# EAGLE board adc8_v2 (EAGLE 5.12), part 1 of 2
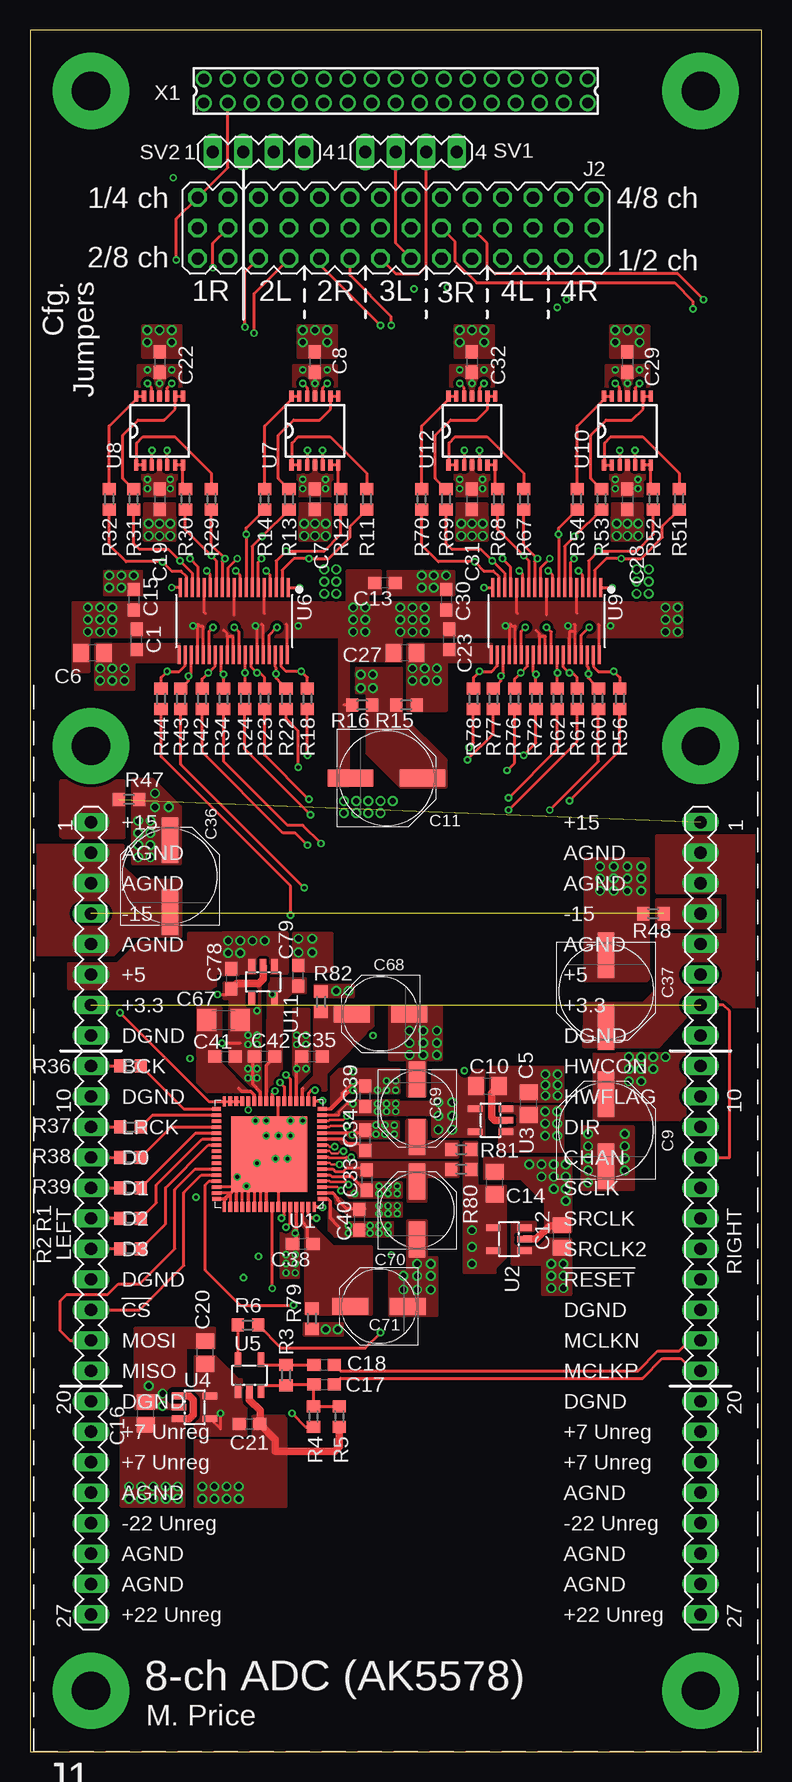
[diagram p3: board, top side]
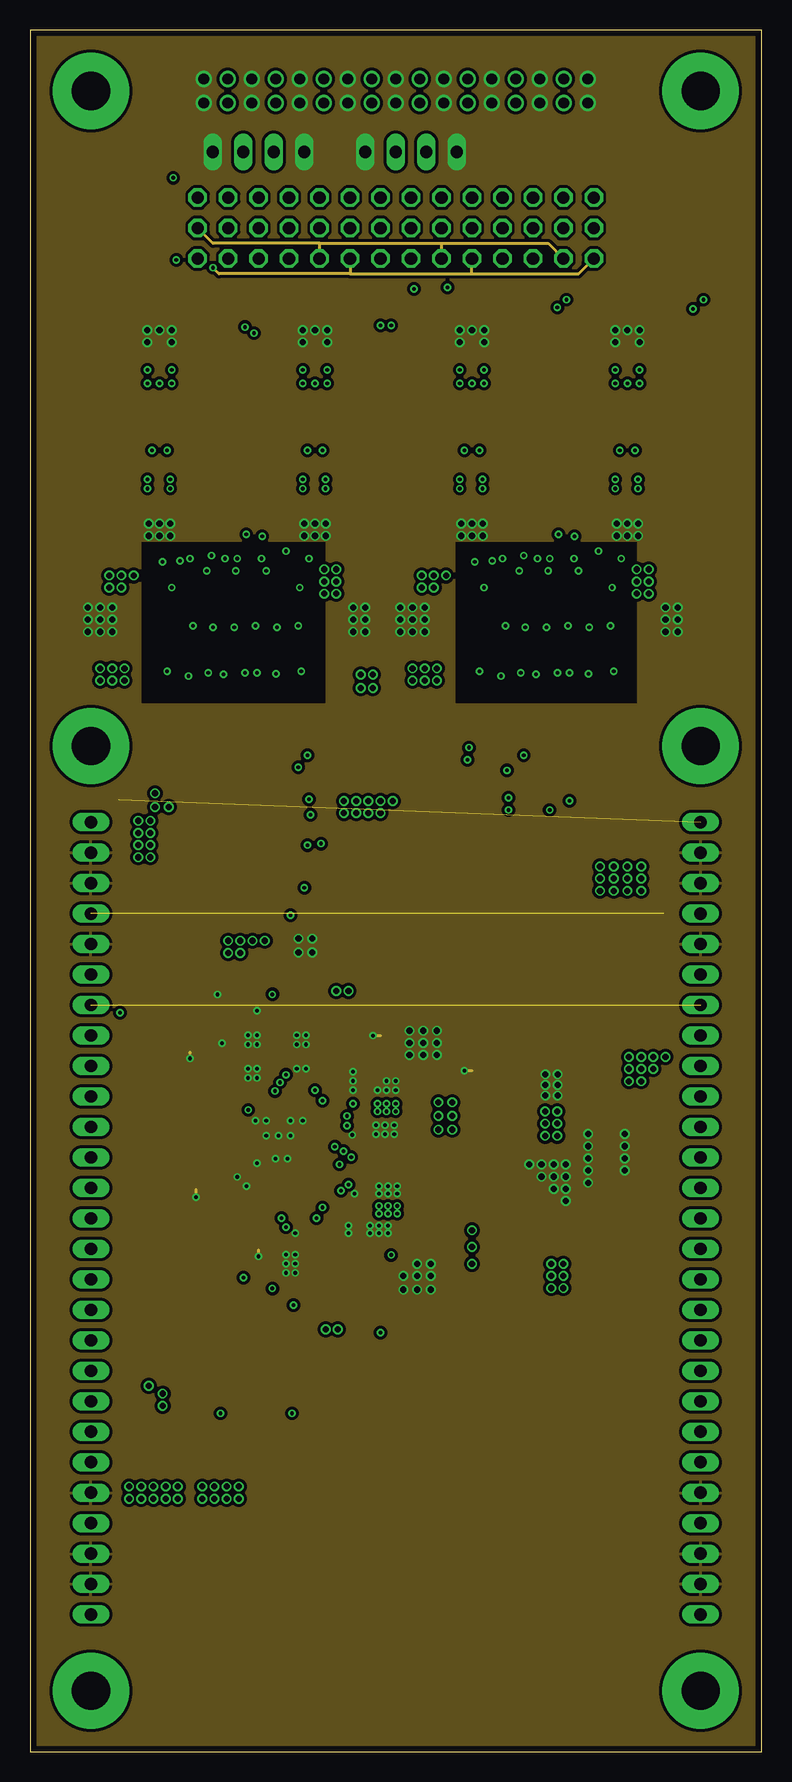
[diagram p4: board, inner layer Route2]
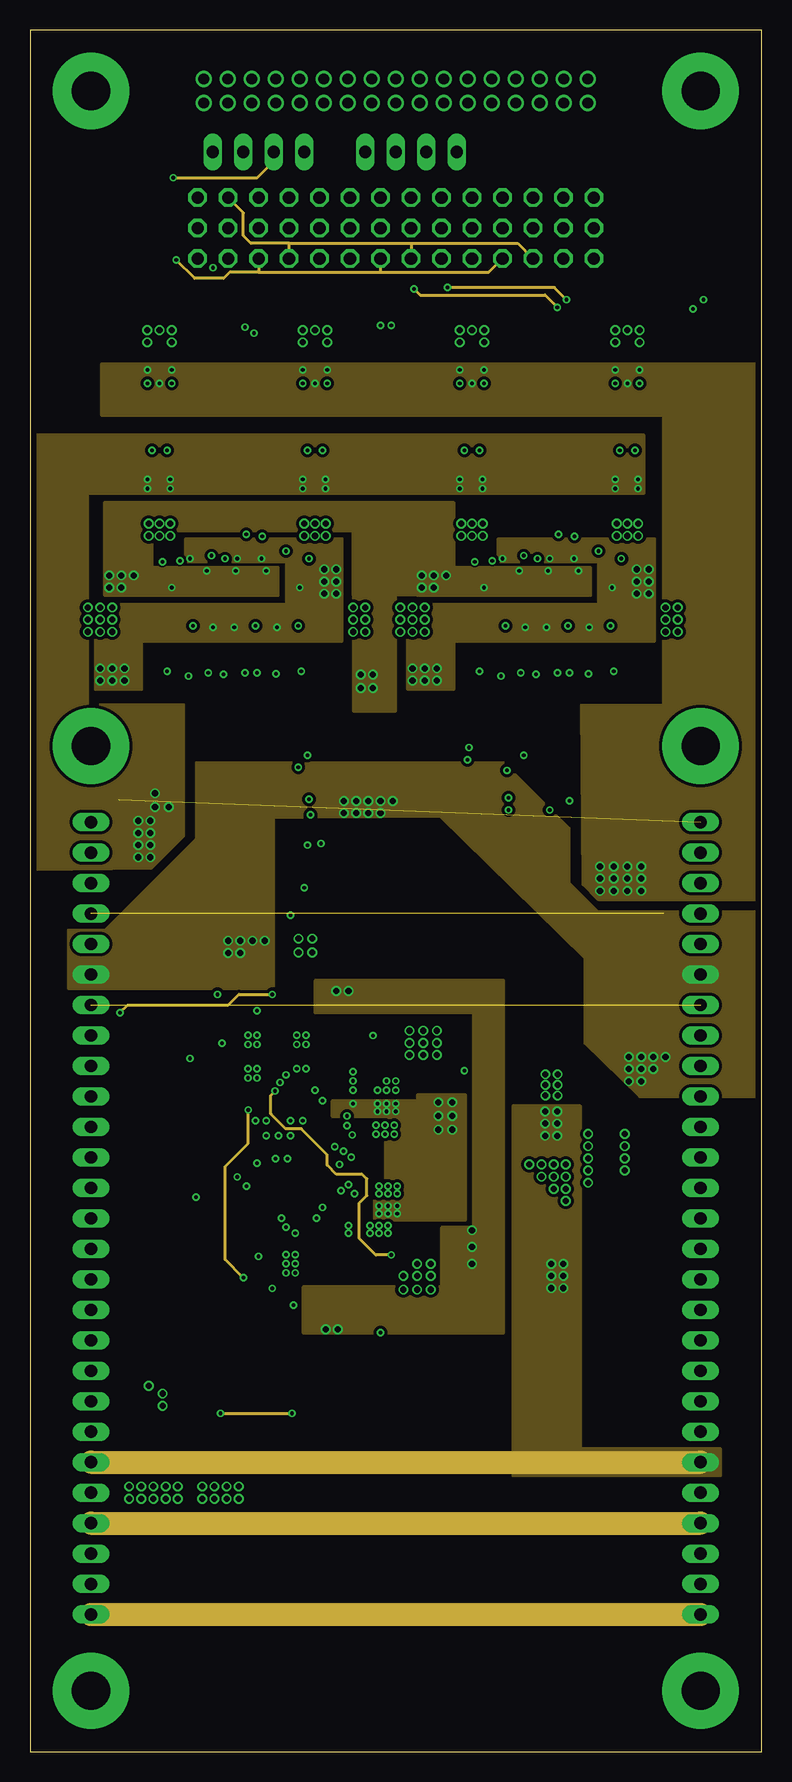
[diagram p5: board, inner layer Route15]
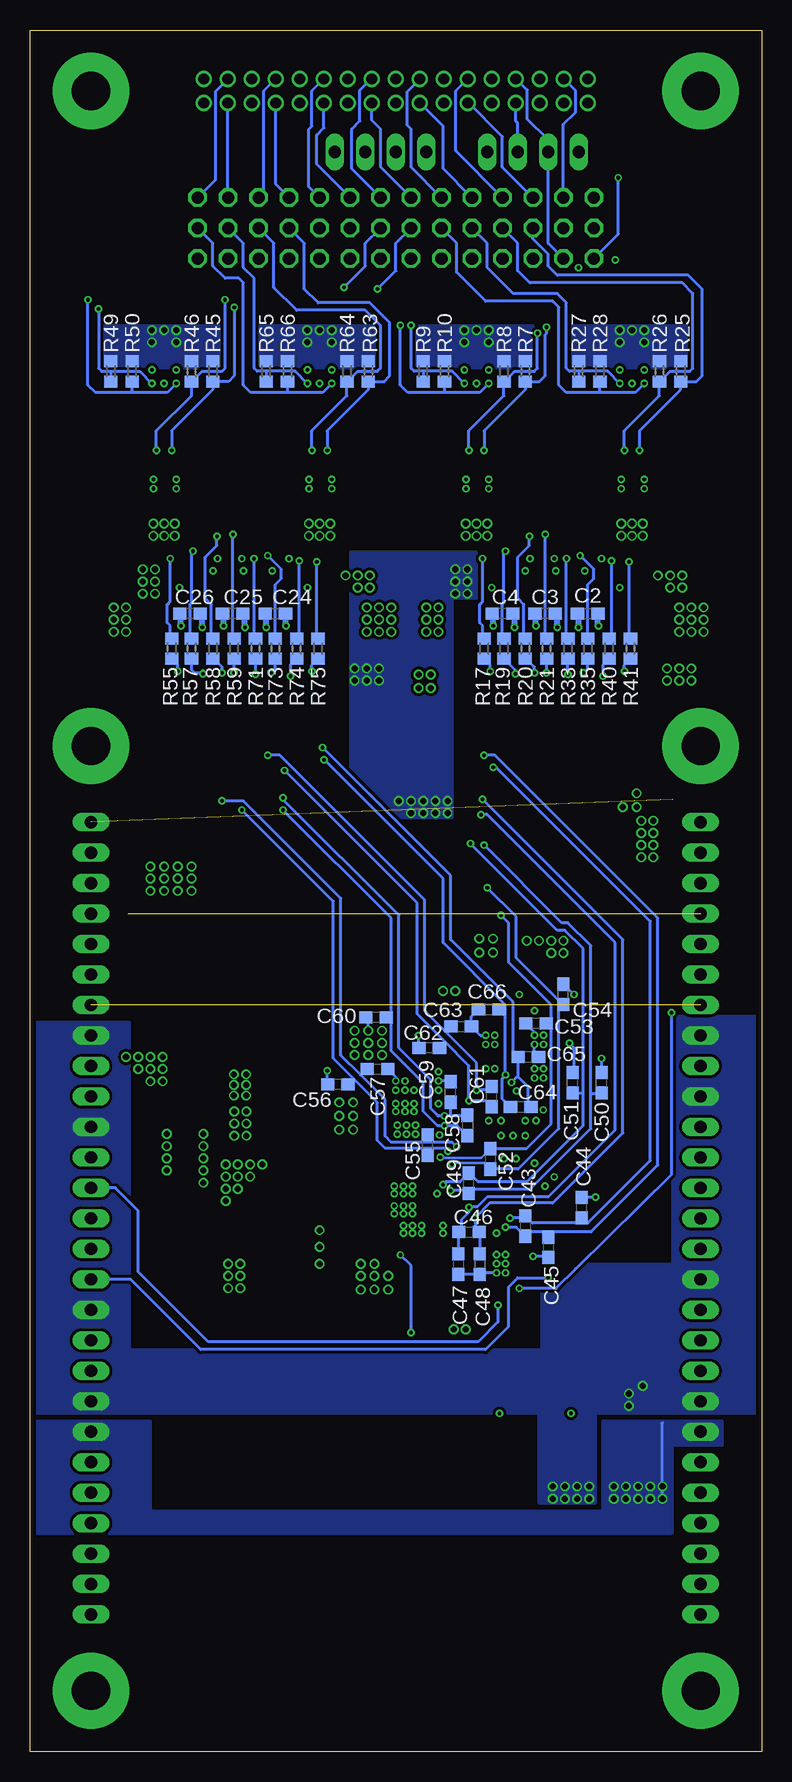
[diagram p6: board, bottom side, seen from below]

Size 60.96 x 143.51 mm. Coordinates in mm from the lower left corner, seen from the top.
Outline: 60.96,143.51 0,143.51 0,0 60.96,0 60.96,143.51
Copper layers (1*2*15*16): Top 0.035mm / dielectric 0.2mm / Route2 0.035mm / dielectric 1.2mm / Route15 0.035mm / dielectric 0.2mm / Bottom 0.035mm
Design rules "Elecrow_4-layer_PCB_eagle_rule": minimum track width 6mil, minimum drill 12mil, track to track 6mil, track to pad 6mil, pad to pad 6mil, via to via 8mil, smd to smd 0mil, copper to edge 20mil, drill to drill 10mil, minimum pad ring 6mil, minimum via ring 6mil, stop-mask expansion 0mil, vias tented up to drill 100mil, thermal gap 10mil

## Footprints (pad centres in the part's own frame; a part is rotated, then mirrored left to right if it is on the bottom)
C0603 = smd 1.1 x 1: 1 -0.85,0; 2 0.85,0
C0805 = smd 1.3 x 1.5: 1 -0.95,0; 2 0.95,0
PANASONIC_E = smd 3.8 x 1.4: + 3,0; - -3,0
C1206 = smd 1.6 x 1.8: 1 -1.4,0; 2 1.4,0
PANASONIC_D = smd 3 x 1.4: + 2.4,0; - -2.4,0
MOD-V2 = drill 1.016 long: 1L -25.4,33.02; 1R 25.4,33.02; 2L -25.4,30.48; 2R 25.4,30.48; 3L -25.4,27.94; 3R 25.4,27.94; 4L -25.4,25.4; 4R 25.4,25.4; 5L -25.4,22.86; 5R 25.4,22.86; 6L -25.4,20.32; 6R 25.4,20.32; 7L -25.4,17.78; 7R 25.4,17.78; 8L -25.4,15.24; 8R 25.4,15.24; 9L -25.4,12.7; 9R 25.4,12.7; 10L -25.4,10.16; 10R 25.4,10.16; 11L -25.4,7.62; 11R 25.4,7.62; 12L -25.4,5.08; 12R 25.4,5.08; 13L -25.4,2.54; 13R 25.4,2.54; 14L -25.4,0; 14R 25.4,0; 15L -25.4,-2.54; 15R 25.4,-2.54; 16L -25.4,-5.08; 16R 25.4,-5.08; 17L -25.4,-7.62; 17R 25.4,-7.62; 18L -25.4,-10.16; 18R 25.4,-10.16; 19L -25.4,-12.7; 19R 25.4,-12.7; 20L -25.4,-15.24; 20R 25.4,-15.24; 21L -25.4,-17.78; 21R 25.4,-17.78; 22L -25.4,-20.32; 22R 25.4,-20.32; 23L -25.4,-22.86; 23R 25.4,-22.86; 24L -25.4,-25.4; 24R 25.4,-25.4; 25L -25.4,-27.94; 25R 25.4,-27.94; 26L -25.4,-30.48; 26R 25.4,-30.48; 27L -25.4,-33.02; 27R 25.4,-33.02 | drill 3.175 pad 6.35 round: DP1 -25.4,39.37; DP2 25.4,39.37; DP3 -25.4,-39.37; DP4 25.4,-39.37
MA14-3 = drill 1.016 octagon: 1A -16.51,-2.54; 1B -16.51,0; 1C -16.51,2.54; 2A -13.97,-2.54; 2B -13.97,0; 2C -13.97,2.54; 3A -11.43,-2.54; 3B -11.43,0; 3C -11.43,2.54; 4A -8.89,-2.54; 4B -8.89,0; 4C -8.89,2.54; 5A -6.35,-2.54; 5B -6.35,0; 5C -6.35,2.54; 6A -3.81,-2.54; 6B -3.81,0; 6C -3.81,2.54; 7A -1.27,-2.54; 7B -1.27,0; 7C -1.27,2.54; 8A 1.27,-2.54; 8B 1.27,0; 8C 1.27,2.54; 9A 3.81,-2.54; 9B 3.81,0; 9C 3.81,2.54; 10A 6.35,-2.54; 10B 6.35,0; 10C 6.35,2.54; 11A 8.89,-2.54; 11B 8.89,0; 11C 8.89,2.54; 12A 11.43,-2.54; 12B 11.43,0; 12C 11.43,2.54; 13A 13.97,-2.54; 13B 13.97,0; 13C 13.97,2.54; 14A 16.51,-2.54; 14B 16.51,0; 14C 16.51,2.54
R0603 = smd 1 x 1.1: 1 -0.85,0; 2 0.85,0
MA04-1 = drill 1.016 long: 1 -3.81,0; 2 -1.27,0; 3 1.27,0; 4 3.81,0
QFN64_EP_AKM = smd 0.8 x 0.3: 1 -4.4,3.75; 2 -4.4,3.25; 3 -4.4,2.75; 4 -4.4,2.25; 5 -4.4,1.75; 6 -4.4,1.25; 7 -4.4,0.75; 8 -4.4,0.25; 9 -4.4,-0.25; 10 -4.4,-0.75; 11 -4.4,-1.25; 12 -4.4,-1.75; 13 -4.4,-2.25; 14 -4.4,-2.75; 15 -4.4,-3.25; 16 -4.4,-3.75; 33 4.4,-3.75; 34 4.4,-3.25; 35 4.4,-2.75; 36 4.4,-2.25; 37 4.4,-1.75; 38 4.4,-1.25; 39 4.4,-0.75; 40 4.4,-0.25; 41 4.4,0.25; 42 4.4,0.75; 43 4.4,1.25; 44 4.4,1.75; 45 4.4,2.25; 46 4.4,2.75; 47 4.4,3.25; 48 4.4,3.75 | smd 0.3 x 0.8: 17 -3.75,-4.4; 18 -3.25,-4.4; 19 -2.75,-4.4; 20 -2.25,-4.4; 21 -1.75,-4.4; 22 -1.25,-4.4; 23 -0.75,-4.4; 24 -0.25,-4.4; 25 0.25,-4.4; 26 0.75,-4.4; 27 1.25,-4.4; 28 1.75,-4.4; 29 2.25,-4.4; 30 2.75,-4.4; 31 3.25,-4.4; 32 3.75,-4.4; 49 3.75,4.4; 50 3.25,4.4; 51 2.75,4.4; 52 2.25,4.4; 53 1.75,4.4; 54 1.25,4.4; 55 0.75,4.4; 56 0.25,4.4; 57 -0.25,4.4; 58 -0.75,4.4; 59 -1.25,4.4; 60 -1.75,4.4; 61 -2.25,4.4; 62 -2.75,4.4; 63 -3.25,4.4; 64 -3.75,4.4 | smd 6.3 x 6.3: EP 0,0
SOT23-DBV = smd 0.55 x 1.2: 1 -0.95,-1.3; 2 0,-1.3; 3 0.95,-1.3; 4 0.95,1.3; 5 -0.95,1.3
TSSOP38_R-PDSO-G38-DA = smd 0.25 x 1.55: 1 -4.5,-2.8; 2 -4,-2.8; 3 -3.5,-2.8; 4 -3,-2.8; 5 -2.5,-2.8; 6 -2,-2.8; 7 -1.5,-2.8; 8 -1,-2.8; 9 -0.5,-2.8; 10 0,-2.8; 11 0.5,-2.8; 12 1,-2.8; 13 1.5,-2.8; 14 2,-2.8; 15 2.5,-2.8; 16 3,-2.8; 17 3.5,-2.8; 18 4,-2.8; 19 4.5,-2.8; 20 4.6,2.8; 21 4.1,2.8; 22 3.6,2.8; 23 3.1,2.8; 24 2.6,2.8; 25 2.1,2.8; 26 1.6,2.8; 27 1.1,2.8; 28 0.6,2.8; 29 0.1,2.8; 30 -0.4,2.8; 31 -0.9,2.8; 32 -1.4,2.8; 33 -1.9,2.8; 34 -2.4,2.8; 35 -2.9,2.8; 36 -3.4,2.8; 37 -3.9,2.8; 38 -4.4,2.8
TSSOP14 = smd 0.9 x 0.35: 1 -2.875,1.95; 2 -2.875,1.3; 3 -2.875,0.65; 4 -2.875,0; 5 -2.875,-0.65; 6 -2.875,-1.3; 7 -2.875,-1.95; 8 2.875,-1.95; 9 2.875,-1.3; 10 2.875,-0.65; 11 2.875,0; 12 2.875,0.65; 13 2.875,1.3; 14 2.875,1.95
87758-3416 = drill 0.9 pad 1.27 round: 1 -16,-1; 2 -16,1; 3 -14,-1; 4 -14,1; 5 -12,-1; 6 -12,1; 7 -10,-1; 8 -10,1; 9 -8,-1; 10 -8,1; 11 -6,-1; 12 -6,1; 13 -4,-1; 14 -4,1; 15 -2,-1; 16 -2,1; 17 0,-1; 18 0,1; 19 2,-1; 20 2,1; 21 4,-1; 22 4,1; 23 6,-1; 24 6,1; 25 8,-1; 26 8,1; 27 10,-1; 28 10,1; 29 12,-1; 30 12,1; 31 14,-1; 32 14,1; 33 16,-1; 34 16,1

## Placement (x,y rotation side)
C1  0.1u  [C0603]  8.89,92.71 90 top
C2  0.1u  [C0603]  14.48,94.87 0 bottom
C3  0.1u  [C0603]  18.03,94.87 180 bottom
C4  0.1u  [C0603]  21.59,94.87 180 bottom
C5  2.2u  [C0805]  41.55,54.03 90 top
C6  2.2u  [C0805]  5.21,91.57 180 top
C7  0.1u  [C0603]  23.75,104.39 270 top
C8  0.1u  [C0603]  23.75,115.82 270 top
C9  220u  [PANASONIC_E]  48.01,51.82 90 top
C10  2.2u  [C0805]  38.13,55.5 0 top
C11  100u  [PANASONIC_E]  29.72,81.15 0 top
C12  2.2u  [C0805]  44.32,42.95 90 top
C13  0.1u  [C0603]  29.59,97.41 180 top
C14  2.2u  [C0805]  38.73,47.4 90 top
C15  1u  [C0603]  8.64,96.01 270 top
C16  2.2u  [C0805]  9.65,28.19 90 top
C17  10n  [C0603]  24.51,30.61 0 top
C18  10n  [C0603]  24.51,32.26 0 top
C19  0.1u  [C0603]  10.79,104.39 270 top
C20  2.2u  [C0805]  14.61,33.27 90 top
C21  0.1u  [C0603]  18.29,27.3 0 top
C22  0.1u  [C0603]  10.79,115.82 270 top
C23  0.1u  [C0603]  34.92,92.71 90 top
C24  0.1u  [C0603]  40.51,94.87 0 bottom
C25  0.1u  [C0603]  44.07,94.87 180 bottom
C26  0.1u  [C0603]  47.62,94.87 180 bottom
C27  2.2u  [C0805]  31.24,91.57 180 top
C28  0.1u  [C0603]  49.78,104.39 270 top
C29  0.1u  [C0603]  49.78,115.82 270 top
C30  1u  [C0603]  34.67,96.01 270 top
C31  0.1u  [C0603]  36.83,104.39 270 top
C32  0.1u  [C0603]  36.83,115.82 270 top
C33  0.1u  [C0603]  28.07,47.65 270 top
C34  0.1u  [C0603]  27.94,50.95 90 top
C35  0.1u  [C0603]  23.5,57.94 180 top
C36  100u  [PANASONIC_E]  11.66,72.97 90 top
C37  100u  [PANASONIC_E]  48.01,63.37 270 top
C38  0.1u  [C0603]  22.73,42.32 180 top
C39  0.1u  [C0603]  27.94,54.64 90 top
C40  0.1u  [C0603]  27.43,44.35 270 top
C41  0.1u  [C0603]  16.26,57.94 0 top
C42  0.1u  [C0603]  19.56,57.94 180 top
C43  15n  [C0603]  19.68,43.81 270 bottom
C44  100p  [C0603]  14.99,45.34 90 bottom
C45  100p  [C0603]  17.78,42.04 270 bottom
C46  15n  [C0603]  24.38,43.31 0 bottom
C47  100p  [C0603]  25.27,40.64 270 bottom
C48  100p  [C0603]  23.5,40.64 270 bottom
C49  15n  [C0603]  24.38,47.37 90 bottom
C50  100p  [C0603]  13.34,55.75 90 bottom
C51  100p  [C0603]  15.75,55.75 90 bottom
C52  15n  [C0603]  22.61,49.4 270 bottom
C53  100p  [C0603]  18.8,60.71 180 bottom
C54  100p  [C0603]  16.51,63.12 90 bottom
C55  15n  [C0603]  27.81,50.55 90 bottom
C56  100p  [C0603]  35.31,55.63 180 bottom
C57  100p  [C0603]  32,56.9 0 bottom
C58  15n  [C0603]  24.51,52.2 270 bottom
C59  100p  [C0603]  25.91,54.99 90 bottom
C60  100p  [C0603]  32.13,61.21 180 bottom
C61  15n  [C0603]  22.48,54.61 90 bottom
C62  100p  [C0603]  27.69,58.67 180 bottom
C63  100p  [C0603]  25.02,60.45 0 bottom
C64  15n  [C0603]  20.07,53.72 180 bottom
C65  100p  [C0603]  19.43,57.91 0 bottom
C66  100p  [C0603]  22.73,61.85 180 bottom
C67  4.7u  [C1206]  16.13,60.99 0 top
C68  100u  [PANASONIC_D]  29.21,61.49 180 top
C69  100u  [PANASONIC_D]  32.26,53.62 270 top
C70  100u  [PANASONIC_D]  32.26,45.11 90 top
C71  100u  [PANASONIC_D]  29.08,37.11 180 top
C78  1u  [C0603]  16.76,64.41 270 top
C79  1u  [C0603]  22.35,64.67 90 top
J1  MOD-V2  [MOD-V2]  30.48,44.45 0 top
J2  JUMPERS-14X3  [MA14-3]  30.48,127 0 top
R1  50  [R0603]  8.38,44.45 180 top
R2  50  [R0603]  8.38,41.91 180 top
R3  100  [R0603]  21.34,31.37 270 top
R4  10k  [R0603]  23.62,27.94 270 top
R5  10k  [R0603]  25.78,27.94 90 top
R6  22  [R0603]  18.16,35.56 180 top
R7  100k  [R0603]  19.68,115.06 90 bottom
R8  100k  [R0603]  21.46,115.06 90 bottom
R9  100k  [R0603]  28.19,115.06 90 bottom
R10  100k  [R0603]  26.42,115.06 90 bottom
R11  2k  [R0603]  28.07,104.39 270 top
R12  2k  [R0603]  25.91,104.39 270 top
R13  2k  [R0603]  21.59,104.39 270 top
R14  2k  [R0603]  19.56,104.39 270 top
R15  2k  [R0603]  31.37,87.25 180 top
R16  2k  [R0603]  27.69,87.25 180 top
R17  1.78k  [R0603]  23.11,91.95 270 bottom
R18  10  [R0603]  23.11,87.76 270 top
R19  1.78k  [R0603]  21.46,91.95 270 bottom
R20  1.78k  [R0603]  19.68,91.95 270 bottom
R21  1.78k  [R0603]  17.91,91.95 270 bottom
R22  10  [R0603]  21.34,87.76 270 top
R23  10  [R0603]  19.56,87.76 270 top
R24  10  [R0603]  17.91,87.76 270 top
R25  100k  [R0603]  6.73,115.06 90 bottom
R26  100k  [R0603]  8.51,115.06 90 bottom
R27  100k  [R0603]  15.24,115.06 90 bottom
R28  100k  [R0603]  13.46,115.06 90 bottom
R29  2k  [R0603]  15.11,104.39 270 top
R30  2k  [R0603]  12.95,104.39 270 top
R31  2k  [R0603]  8.64,104.39 270 top
R32  2k  [R0603]  6.6,104.39 270 top
R33  1.78k  [R0603]  16.13,91.95 270 bottom
R34  10  [R0603]  16.13,87.76 270 top
R35  1.78k  [R0603]  14.48,91.95 270 bottom
R36  50  [R0603]  8.38,57.15 180 top
R37  50  [R0603]  8.38,52.07 180 top
R38  50  [R0603]  8.38,49.53 180 top
R39  50  [R0603]  8.38,46.99 180 top
R40  1.78k  [R0603]  12.7,91.95 270 bottom
R41  1.78k  [R0603]  10.92,91.95 270 bottom
R42  10  [R0603]  14.35,87.76 270 top
R43  10  [R0603]  12.57,87.76 270 top
R44  10  [R0603]  10.92,87.76 270 top
R45  100k  [R0603]  45.72,115.06 90 bottom
R46  100k  [R0603]  47.5,115.06 90 bottom
R47  0  [R0603]  8.26,79.38 180 top
R48  0  [R0603]  51.94,69.85 0 top
R49  100k  [R0603]  54.23,115.06 90 bottom
R50  100k  [R0603]  52.45,115.06 90 bottom
R51  2k  [R0603]  54.1,104.39 270 top
R52  2k  [R0603]  51.94,104.39 270 top
R53  2k  [R0603]  47.62,104.39 270 top
R54  2k  [R0603]  45.59,104.39 270 top
R55  1.78k  [R0603]  49.15,91.95 270 bottom
R56  10  [R0603]  49.15,87.76 270 top
R57  1.78k  [R0603]  47.5,91.95 270 bottom
R58  1.78k  [R0603]  45.72,91.95 270 bottom
R59  1.78k  [R0603]  43.94,91.95 270 bottom
R60  10  [R0603]  47.37,87.76 270 top
R61  10  [R0603]  45.59,87.76 270 top
R62  10  [R0603]  43.94,87.76 270 top
R63  100k  [R0603]  32.77,115.06 90 bottom
R64  100k  [R0603]  34.54,115.06 90 bottom
R65  100k  [R0603]  41.27,115.06 90 bottom
R66  100k  [R0603]  39.5,115.06 90 bottom
R67  2k  [R0603]  41.15,104.39 270 top
R68  2k  [R0603]  38.99,104.39 270 top
R69  2k  [R0603]  34.67,104.39 270 top
R70  2k  [R0603]  32.64,104.39 270 top
R71  1.78k  [R0603]  42.16,91.95 270 bottom
R72  10  [R0603]  42.16,87.76 270 top
R73  1.78k  [R0603]  40.51,91.95 270 bottom
R74  1.78k  [R0603]  38.73,91.95 270 bottom
R75  1.78k  [R0603]  36.96,91.95 270 bottom
R76  10  [R0603]  40.39,87.76 270 top
R77  10  [R0603]  38.61,87.76 270 top
R78  10  [R0603]  36.96,87.76 270 top
R79  22  [R0603]  23.5,36.09 90 top
R80  22  [R0603]  35.94,48.54 180 top
R81  22  [R0603]  35.94,50.19 180 top
R82  22  [R0603]  24.26,62.51 270 top
SV1  [MA04-1]  31.75,133.35 0 top
SV2  [MA04-1]  19.05,133.35 0 top
U1  [QFN64_EP_AKM]  19.94,49.81 180 top
U2  ADP7118AUJZ-5.0  [SOT23-DBV]  39.9,42.72 90 top
U3  ADP7118AUJZ-5.0  [SOT23-DBV]  38.38,52.63 90 top
U4  ADP7118AUJZ-3.3  [SOT23-DBV]  13.72,28.7 270 top
U5  DS90LV012  [SOT23-DBV]  18.29,31.37 0 top
U6  THS4524  [TSSOP38_R-PDSO-G38-DA]  17.02,94.23 180 top
U7  OPA1664PW  [TSSOP14]  23.75,110.11 90 top
U8  OPA1664PW  [TSSOP14]  10.79,110.11 90 top
U9  THS4524  [TSSOP38_R-PDSO-G38-DA]  43.05,94.23 180 top
U10  OPA1664PW  [TSSOP14]  49.78,110.11 90 top
U11  ADM7160  [SOT23-DBV]  19.43,64.16 180 top
U12  OPA1664PW  [TSSOP14]  36.83,110.11 90 top
X1  87758-3416  [87758-3416]  30.48,138.43 0 top